# EAGLE schematic StockTicker (EAGLE 8.7.1)
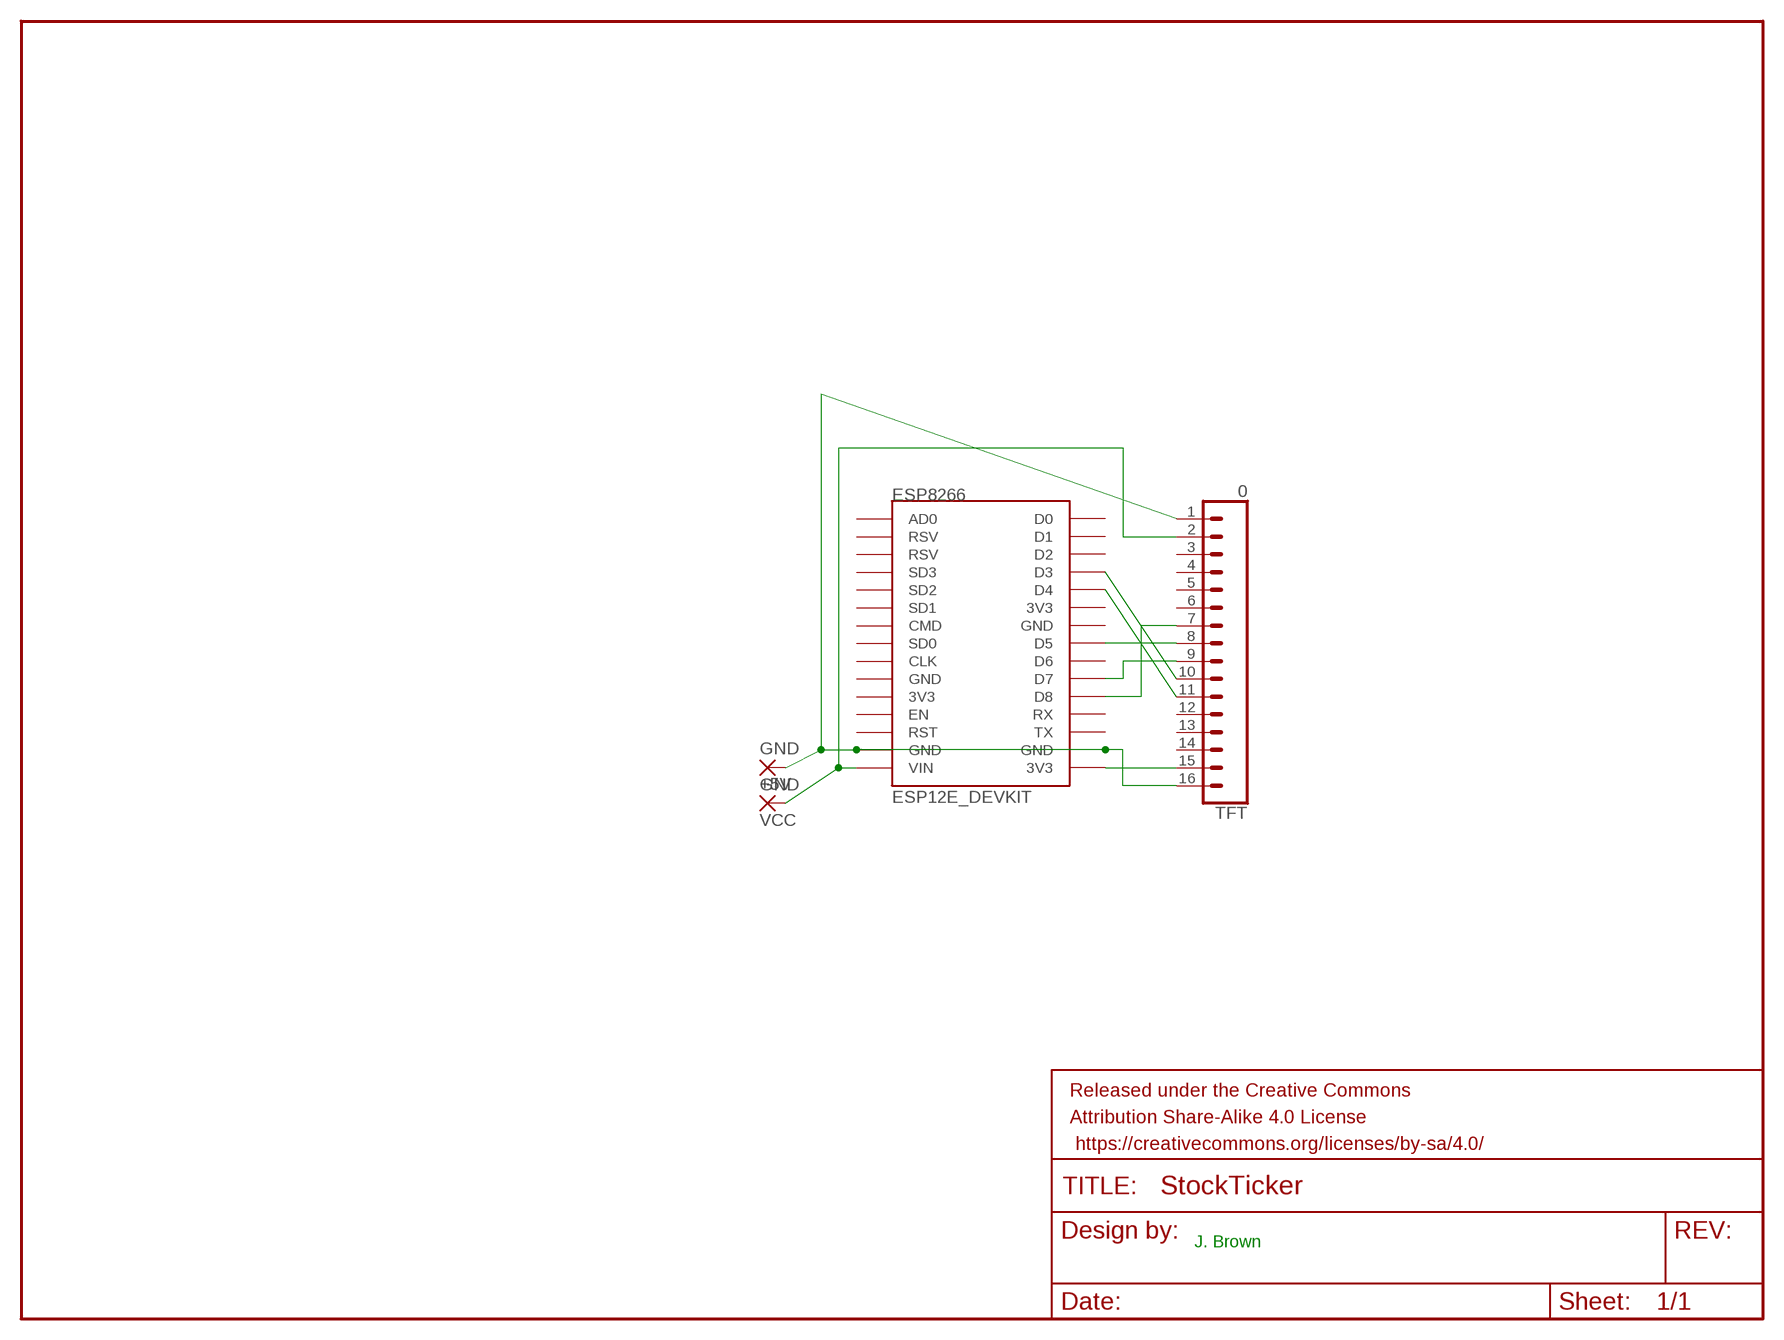
[diagram p0: schematic, sheet 1]

## Parts
+5V  VCC  2,15/1,0  [2,15/1,0]
ESP8266  ESP12E_DEVKIT  [ESP12E_DEVKIT]
FRAME1  FRAME-LETTER  [CREATIVE_COMMONS]
GND  GND  2,15/1,0  [2,15/1,0]
TFT  0  CONN_16  [1X16]

## Nets
GND: ESP8266.GND@1(GND) ESP8266.GND@3(GND) GND.1(P) TFT.1 TFT.16
N$1: ESP8266.3V3@2(3V3) TFT.15
N$5: ESP8266.D8 TFT.7
N$6: ESP8266.D5 TFT.8
N$7: ESP8266.D7 TFT.9
N$8: ESP8266.D4 TFT.11
N$9: ESP8266.D3 TFT.10
VCC: +5V.1(P) ESP8266.VIN TFT.2
Unconnected: ESP8266.3V3@0(3V3) ESP8266.3V3@1(3V3) ESP8266.AD0 ESP8266.CLK ESP8266.CMD ESP8266.D0 ESP8266.D1 ESP8266.D2 ESP8266.D6 ESP8266.EN ESP8266.GND@0(GND) ESP8266.GND@2(GND) ESP8266.RST ESP8266.RSV@0(RSV) ESP8266.RSV@1(RSV) ESP8266.RX ESP8266.SD0 ESP8266.SD1 ESP8266.SD2 ESP8266.SD3 ESP8266.TX TFT.3 TFT.4 TFT.5 TFT.6 TFT.12 TFT.13 TFT.14

## Notes on the sheet
- J. Brown

## Library data of the parts
+5V GND = wirepad:2,15/1,0: THROUGH-HOLE PAD
ESP8266 = ESP12E_DEVKIT:ESP12E_DEVKIT: ESP12E DEVKIT BOARD
FRAME1 = SparkFun-Aesthetics:FRAME-LETTER: Schematic Frame - Letter Standard 8.5x11 US Letter frame
TFT = SparkFun-Connectors:CONN_16: Multi connection point. Often used as Generic Header-pin footprint for 0.1 inch spaced/style header connections On any of the 0.1 inch spaced packages, you can populate with these: Break Away Headers - Straight <https://www.sparkfun.com/products/116> (PRT-00116) Break Away Male Headers - Right Angle <https://www.sparkfun.com/products/553> (PRT-00553) Female Headers <https://www.sparkfun.com/products/115> (PRT-00115) Break Away Headers - Machine Pin <https://www.sparkfun.com/products/117> (PRT-00117) Break Away Female Headers - Swiss Machine Pin <https://www.sparkfun.com/products/743> (PRT-00743) For SCREWTERMINALS and SPRING TERMINALS visit here: Screw Terimnals on SparkFun.com <https://www.sparkfun.com/search/results?term=Screw+Terminals> (5mm/3.5mm/2.54mm spacing) This device is also useful as a general connection point to wire up your design to another part of your project. Our various solder wires solder well into these plated through hole pads. Hook-Up Wire - Assortment (Stranded, 22 AWG) <https://www.sparkfun.com/products/11375> (PRT-11375) Hook-Up Wire - Assortment (Solid Core, 22 AWG) <https://www.sparkfun.com/products/11367> (PRT-11367) View the entire wire category on our website here <https://www.sparkfun.com/categories/141> Special notes: Molex polarized connector foot print use with SKU : PRT-08231 with associated crimp pins and housings. 1MM SMD Version SKU: PRT-10208 NOTES ON THE VARIANTS LOCK and LOCK_LONGPADS... This footprint was designed to help hold the alignment of a through-hole component (i.e. 6-pin header) while soldering it into place. You may notice that each hole has been shifted either up or down by 0.005 of an inch from it's more standard position (which is a perfectly straight line). This slight alteration caused the pins (the squares in the middle) to touch the edges of the holes. Because they are alternating, it causes a "brace" to hold the component in place. 0.005 has proven to be the perfect amount of "off-center" position when using our standard breakaway headers. Although looks a little odd when you look at the bare footprint, once you have a header in there, the alteration is very hard to notice. Also,if you push a header all the way into place, it is covered up entirely on the bottom side.